# EAGLE schematic smartstand-amplifier-rev-a (EAGLE 7.3.0)

## Sheet 1 of 5
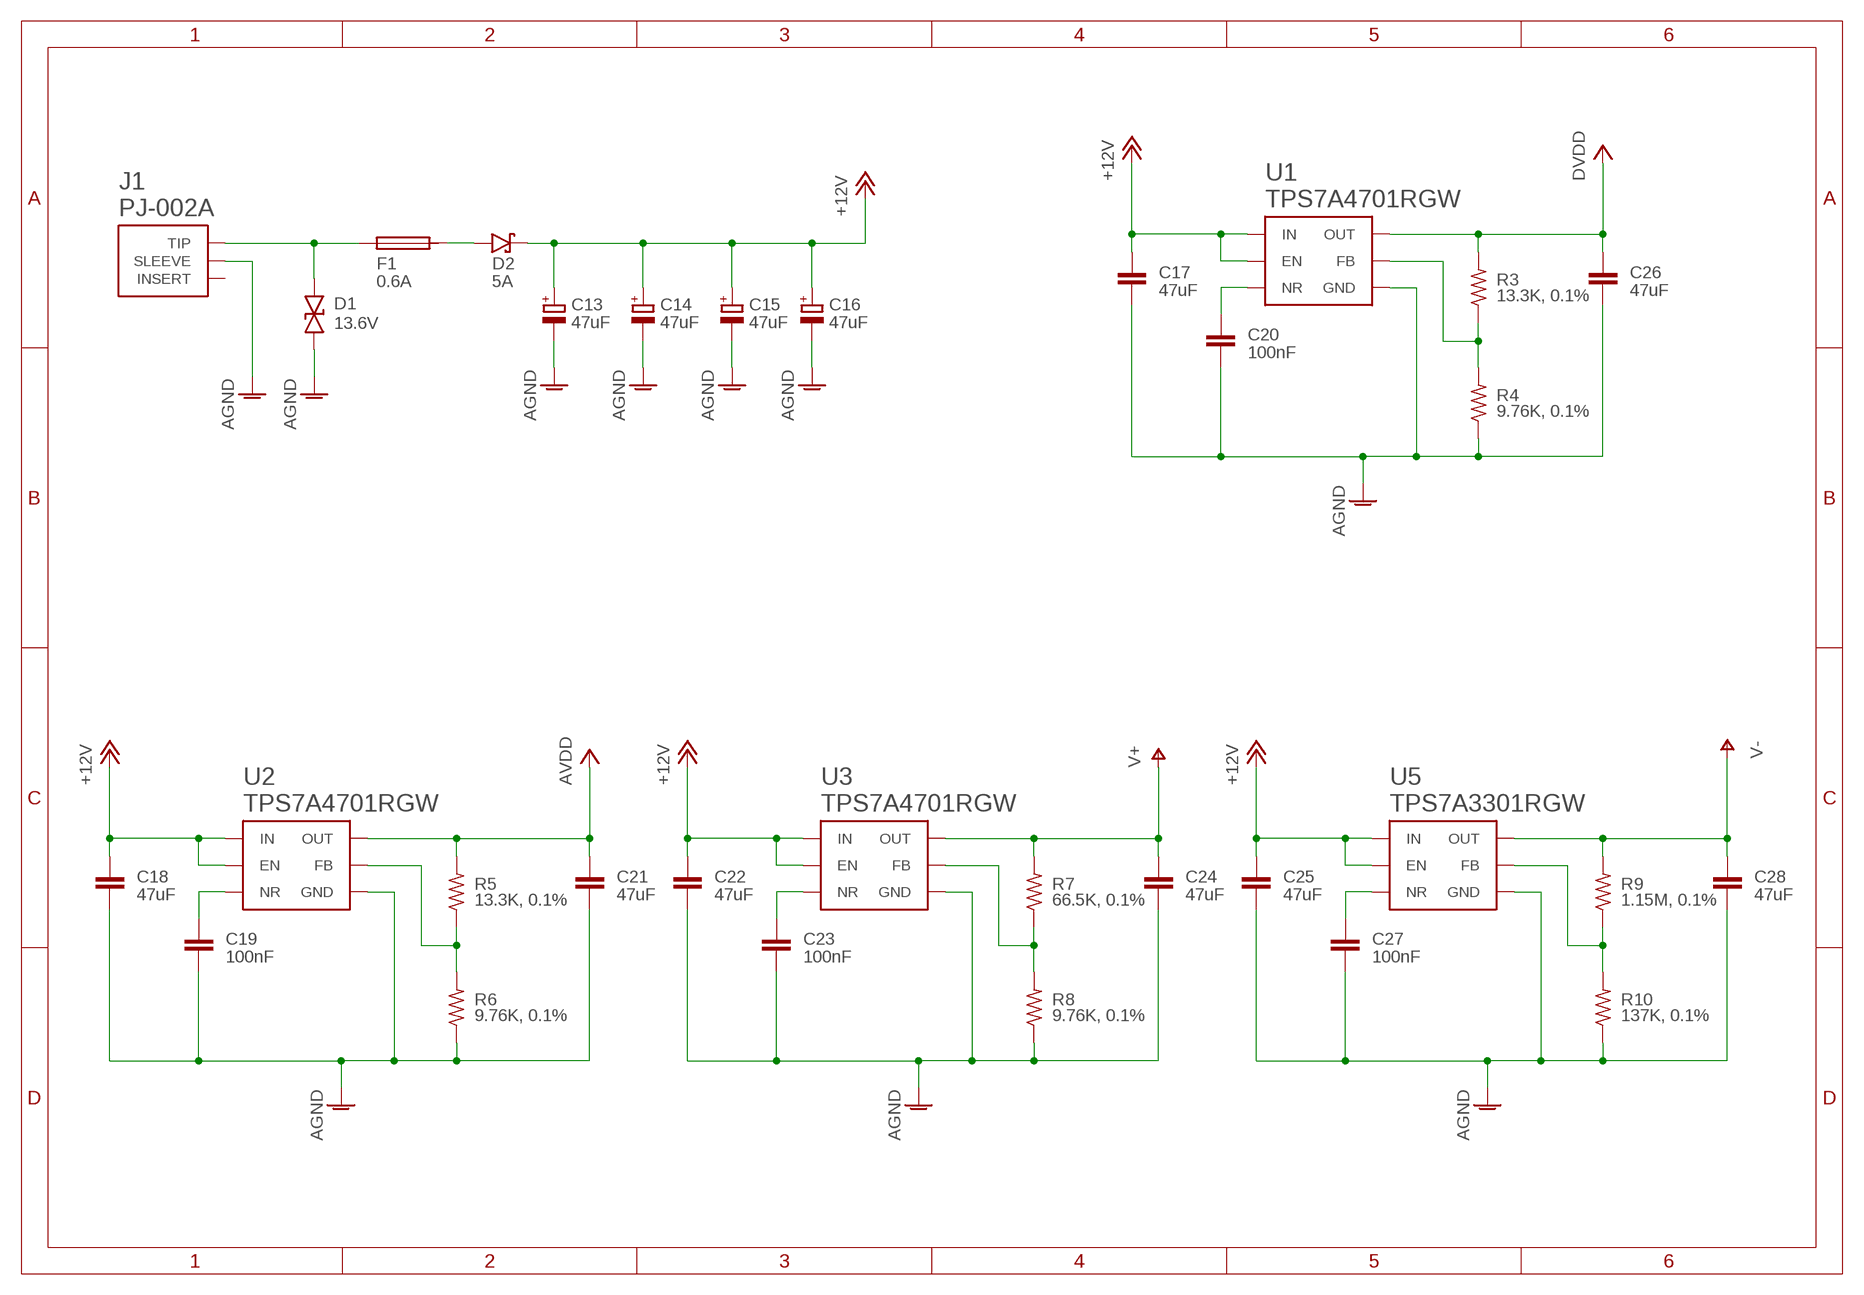
[diagram p0: schematic, sheet 1]

### Parts
C13  47uF  CPOL-EUCHEMICON_F55  [CHEMICON_F55]
C14  47uF  CPOL-EUCHEMICON_F55  [CHEMICON_F55]
C15  47uF  CPOL-EUCHEMICON_F55  [CHEMICON_F55]
C16  47uF  CPOL-EUCHEMICON_F55  [CHEMICON_F55]
C17  47uF  CAPACITOR-0805  [C0805]
C18  47uF  CAPACITOR-0805  [C0805]
C19  100nF  CAPACITOR-0402  [C0402]
C20  100nF  CAPACITOR-0402  [C0402]
C21  47uF  CAPACITOR-0805  [C0805]
C22  47uF  CAPACITOR-0805  [C0805]
C23  100nF  CAPACITOR-0402  [C0402]
C24  47uF  CAPACITOR-0805  [C0805]
C25  47uF  CAPACITOR-0805  [C0805]
C26  47uF  CAPACITOR-0805  [C0805]
C27  100nF  CAPACITOR-0402  [C0402]
C28  47uF  CAPACITOR-0805  [C0805]
D1  13.6V  SUPPRESSOR-DUAL-SMA  [SMA]
D2  5A  PMEG3050BEP  [SOD128]
F1  0.6A  LITTLEFUSE2920L  [2920L]
J1  PJ-002A  [PJ-002A]
R3  13.3K, 0.1%  R-US-VERTICALR0402  [R0402]
R4  9.76K, 0.1%  R-US-VERTICALR0402  [R0402]
R5  13.3K, 0.1%  R-US-VERTICALR0402  [R0402]
R6  9.76K, 0.1%  R-US-VERTICALR0402  [R0402]
R7  66.5K, 0.1%  R-US-VERTICALR0402  [R0402]
R8  9.76K, 0.1%  R-US-VERTICALR0402  [R0402]
R9  1.15M, 0.1%  R-US-VERTICALR0402  [R0402]
R10  137K, 0.1%  R-US-VERTICALR0402  [R0402]
U1  TPS7A4701RGW  [S-PVQFN-N20]
U2  TPS7A4701RGW  [S-PVQFN-N20]
U3  TPS7A4701RGW  [S-PVQFN-N20]
U5  TPS7A3301RGW  [S-PVQFN-N20]

### Nets
+10V: C24.1 R7.2 U3.P$1(OUT) U3.P$20(OUT) ; supply symbol labelled V+
+12V: C13.+ C14.+ C15.+ C16.+ C17.1 C18.1 C22.1 C25.1 D2.C U1.P$13(EN) U1.P$15(IN) U1.P$16(IN) U2.P$13(EN) U2.P$15(IN) U2.P$16(IN) U3.P$13(EN) U3.P$15(IN) U3.P$16(IN) U5.P$13(EN) U5.P$15(IN) U5.P$16(IN) ; also sheet 3
AGND: C13.- C14.- C15.- C16.- C17.2 C18.2 C19.2 C20.2 C21.2 C22.2 C23.2 C24.2 C25.2 C26.2 C27.2 C28.2 D1.A J1.2(SLEEVE) R4.1 R6.1 R8.1 R10.1 U1.P$7(GND) U1.P$21(GND) U1.P$22(GND) U1.P$23(GND) U1.P$24(GND) U1.P$25(GND) U1.P$26(GND) U1.P$27(GND) U1.P$28(GND) U1.P$29(GND) U1.P$EP(GND) U2.P$7(GND) U2.P$21(GND) U2.P$22(GND) U2.P$23(GND) U2.P$24(GND) U2.P$25(GND) U2.P$26(GND) U2.P$27(GND) U2.P$28(GND) U2.P$29(GND) U2.P$EP(GND) U3.P$7(GND) U3.P$21(GND) U3.P$22(GND) U3.P$23(GND) U3.P$24(GND) U3.P$25(GND) U3.P$26(GND) U3.P$27(GND) U3.P$28(GND) U3.P$29(GND) U3.P$EP(GND) U5.P$7(GND) U5.P$21(GND) U5.P$22(GND) U5.P$23(GND) U5.P$24(GND) U5.P$25(GND) U5.P$26(GND) U5.P$27(GND) U5.P$28(GND) U5.P$29(GND) U5.P$EP(GND) ; also sheet 2,3,4,5
AVDD: C21.1 R5.2 U2.P$1(OUT) U2.P$20(OUT) ; also sheet 2
DVDD: C26.1 R3.2 U1.P$1(OUT) U1.P$20(OUT) ; also sheet 2
N$7: D1.C F1.P$1 J1.1(TIP)
N$8: D2.A F1.P$2
N$9: C20.1 U1.P$14(NR)
N$10: C19.1 U2.P$14(NR)
N$11: R3.1 R4.2 U1.P$3(FB)
N$12: R5.1 R6.2 U2.P$3(FB)
N$13: C23.1 U3.P$14(NR)
N$14: R7.1 R8.2 U3.P$3(FB)
N$15: C27.1 U5.P$14(NR)
N$16: R9.1 R10.2 U5.P$3(FB)
V-: C28.1 R9.2 U5.P$1(OUT) U5.P$20(OUT) ; also sheet 3,4
Unconnected: J1.3(INSERT)

## Sheet 2 of 5
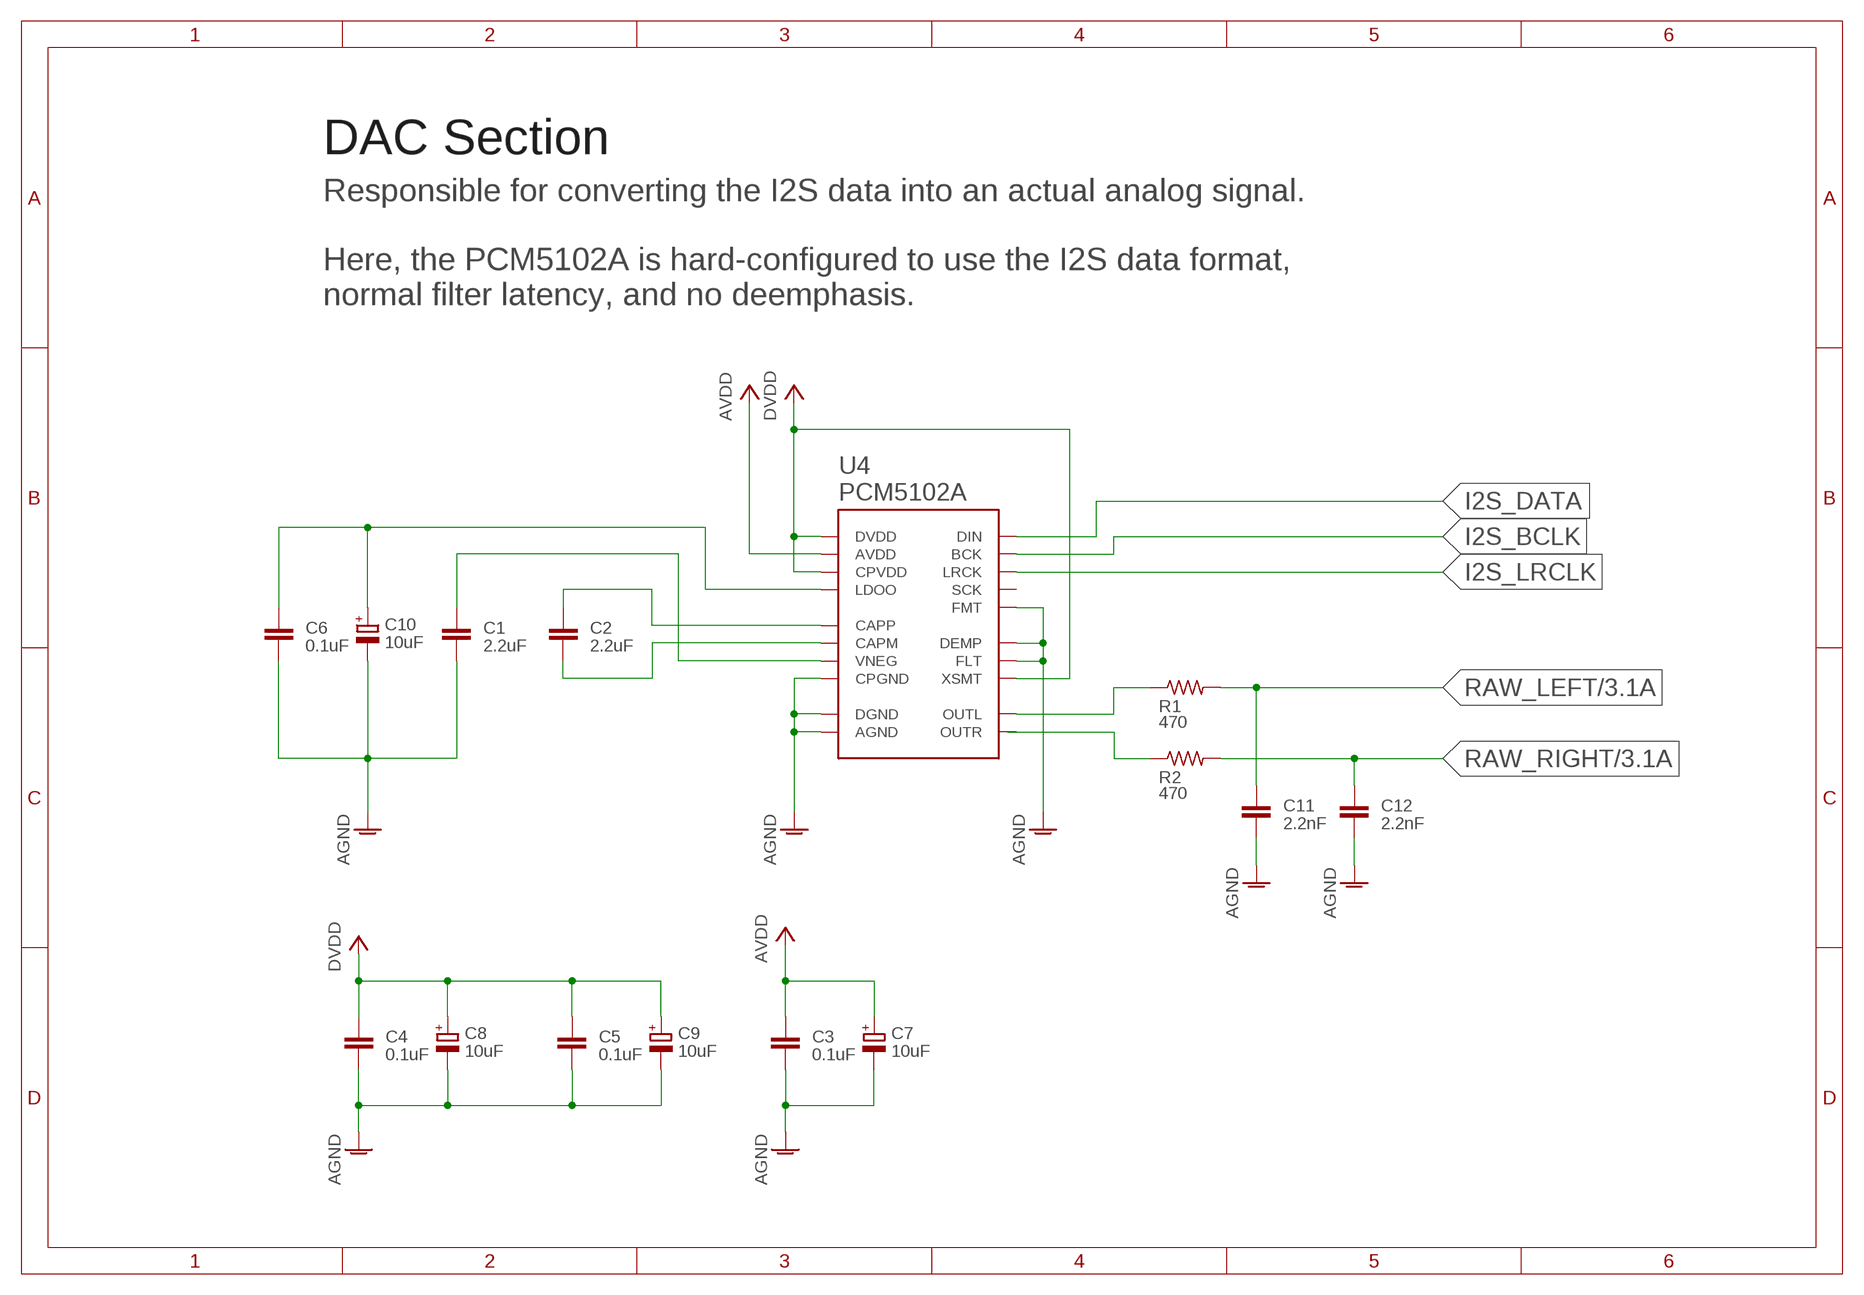
[diagram p1: schematic, sheet 2]

### Parts
C1  2.2uF  CAPACITOR-0603  [C0603]
C2  2.2uF  CAPACITOR-0603  [C0603]
C3  0.1uF  CAPACITOR-0402  [C0402]
C4  0.1uF  CAPACITOR-0402  [C0402]
C5  0.1uF  CAPACITOR-0402  [C0402]
C6  0.1uF  CAPACITOR-0402  [C0402]
C7  10uF  CPOL-EUB  [PANASONIC_B]
C8  10uF  CPOL-EUB  [PANASONIC_B]
C9  10uF  CPOL-EUB  [PANASONIC_B]
C10  10uF  CPOL-EUB  [PANASONIC_B]
C11  2.2nF  CAPACITOR-0402  [C0402]
C12  2.2nF  CAPACITOR-0402  [C0402]
R1  470  R-US_R0402  [R0402]
R2  470  R-US_R0402  [R0402]
U4  PCM5102A  [R-PDSO-G20]

### Nets
AGND: C1.2 C3.2 C4.2 C5.2 C6.2 C7.- C8.- C9.- C10.- C11.2 C12.2 U4.P$3(CPGND) U4.P$9(AGND) U4.P$10(DEMP) U4.P$11(FLT) U4.P$16(FMT) U4.P$19(DGND) ; also sheet 1,3,4,5
AVDD: C3.1 C7.+ U4.P$8(AVDD) ; also sheet 1
DVDD: C4.1 C5.1 C8.+ C9.+ U4.P$1(CPVDD) U4.P$17(XSMT) U4.P$20(DVDD) ; also sheet 1
I2S_BCLK: U4.P$13(BCK)
I2S_DATA: U4.P$14(DIN)
I2S_LRCLK: U4.P$15(LRCK)
N$1: C2.1 U4.P$2(CAPP)
N$2: C2.2 U4.P$4(CAPM)
N$3: C1.1 U4.P$5(VNEG)
N$4: C6.1 C10.+ U4.P$18(LDOO)
N$5: R1.1 U4.P$6(OUTL)
N$6: R2.1
RAW_LEFT: C11.1 R1.2 ; also sheet 3
RAW_RIGHT: C12.1 R2.2 ; also sheet 3
Unconnected: U4.P$7(OUTR) U4.P$12(SCK)

### Notes on the sheet
- DAC Section
- Responsible for converting the I2S data into an actual analog signal.
  
  Here, the PCM5102A is hard-configured to use the I2S data format, 
  normal filter latency, and no deemphasis.

## Sheet 3 of 5
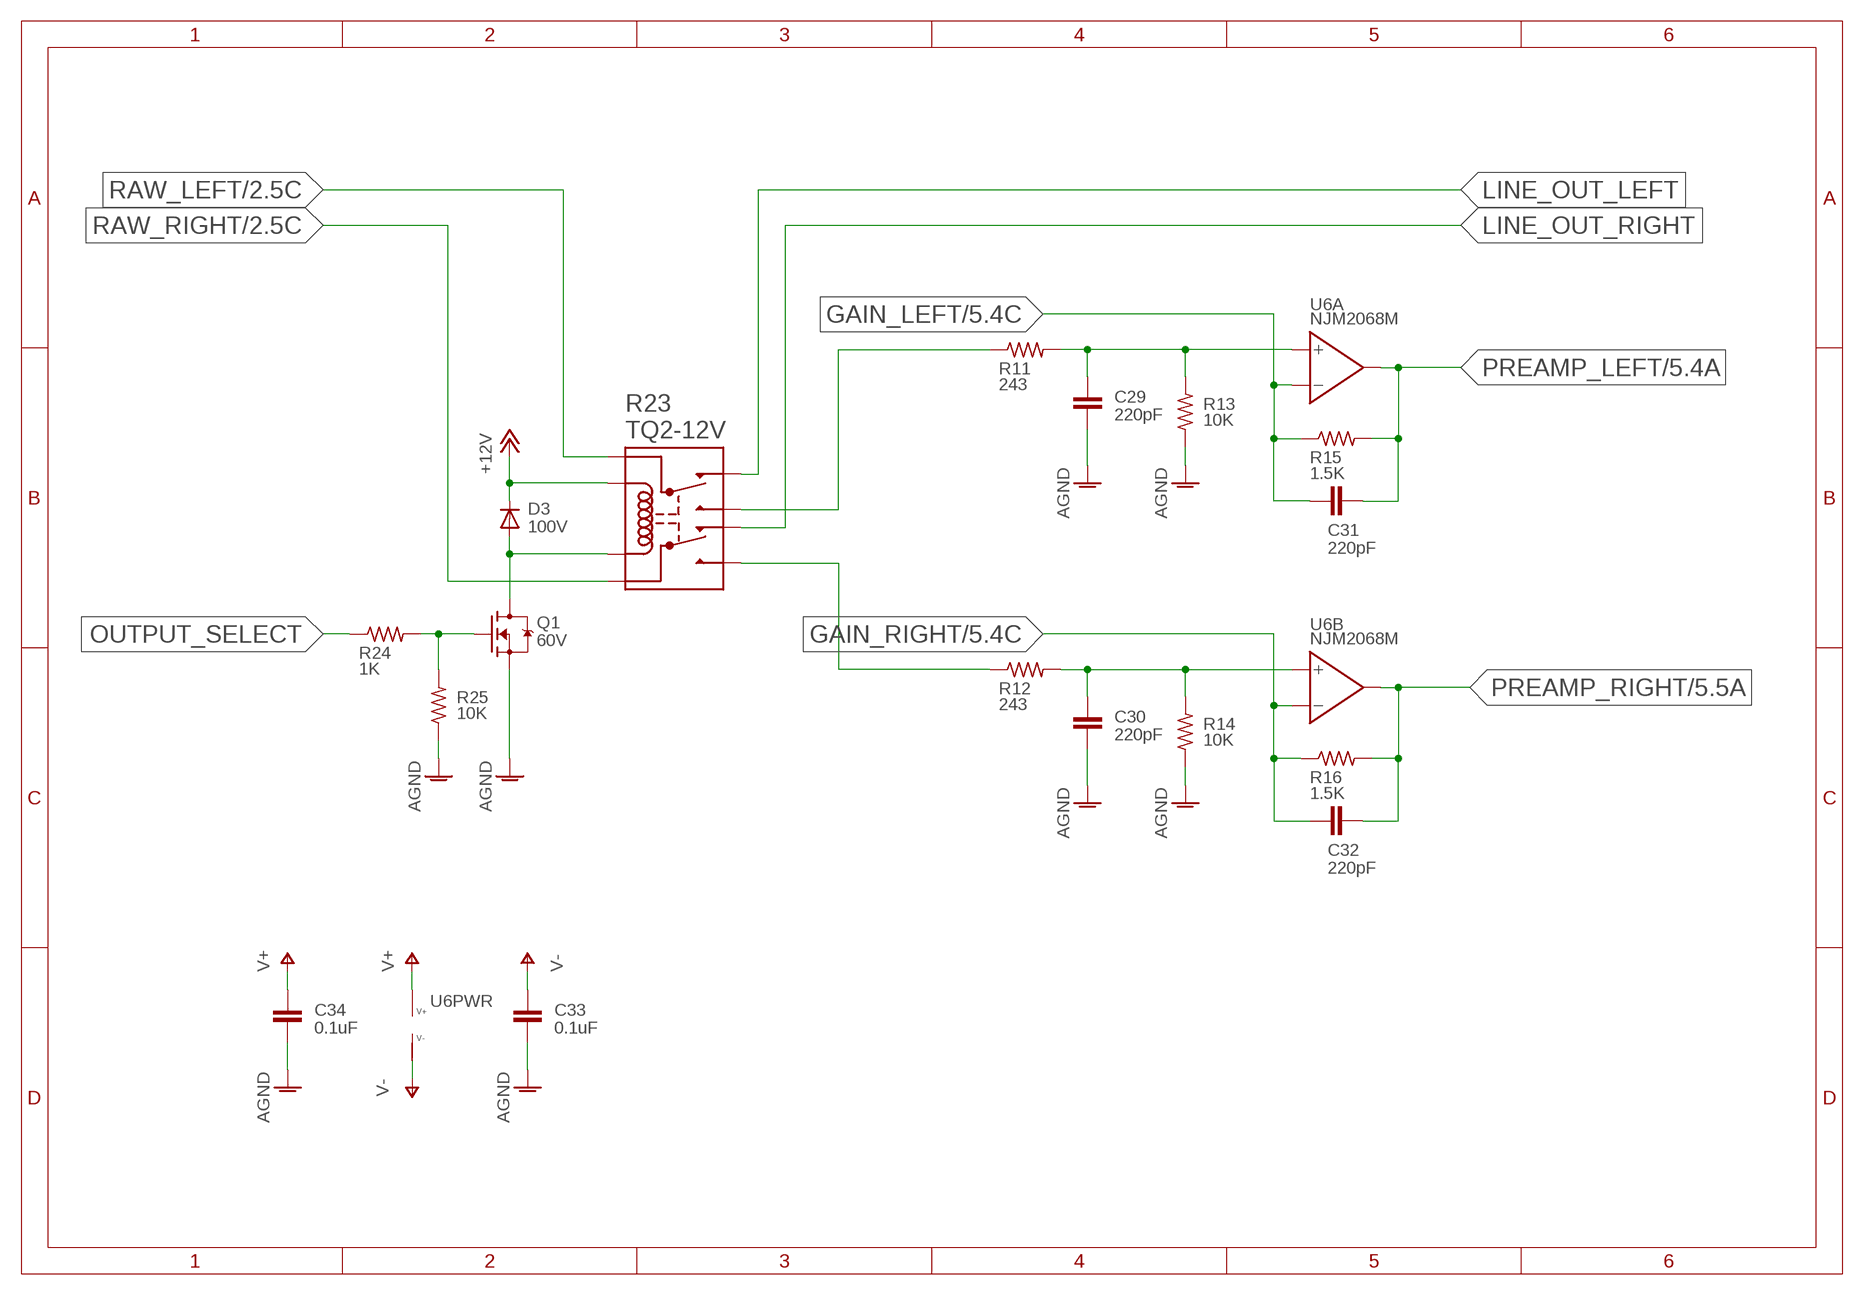
[diagram p2: schematic, sheet 3]

### Parts
C29  220pF  CAPACITOR-0402  [C0402]
C30  220pF  CAPACITOR-0402  [C0402]
C31  220pF  CAPACITOR-HORIZONTAL-0402  [C0402]
C32  220pF  CAPACITOR-HORIZONTAL-0402  [C0402]
C33  0.1uF  CAPACITOR-0402  [C0402]
C34  0.1uF  CAPACITOR-0402  [C0402]
D3  100V  DIODE-VERTICALSOD123  [SOD123]
Q1  60V  N-MOSFET-SC70  [SC-70]
R11  243  R-US_R0402  [R0402]
R12  243  R-US_R0402  [R0402]
R13  10K  R-US-VERTICALR0402  [R0402]
R14  10K  R-US-VERTICALR0402  [R0402]
R15  1.5K  R-US_R0402  [R0402]
R16  1.5K  R-US_R0402  [R0402]
R23  TQ2-12V  [TQ2]
R24  1K  R-US_R0402  [R0402]
R25  10K  R-US-VERTICALR0402  [R0402]
U6  NJM2068M  [DMP8]

### Nets
+12V: D3.C R23.P$1(COIL_P) ; also sheet 1
AGND: C29.2 C30.2 C33.2 C34.2 Q1.P$2(S) R13.1 R14.1 R25.1 ; also sheet 1,2,4,5
GAIN_LEFT: C31.1 R15.1 U6.P$2(A:-IN) ; also sheet 5
GAIN_RIGHT: C32.1 R16.1 U6.P$6(B:-IN) ; also sheet 5
LINE_OUT_LEFT: R23.P$2(NC1)
LINE_OUT_RIGHT: R23.P$9(NC2)
N$17: C29.1 R11.2 R13.2 U6.P$3(A:+IN)
N$18: C30.1 R12.2 R14.2 U6.P$5(B:+IN)
N$23: R11.1 R23.P$4(NO1)
N$26: R12.1 R23.P$7(NO2)
N$27: Q1.P$1(G) R24.2 R25.2
N$29: D3.A Q1.P$3(D) R23.P$10(COIL_N)
OUTPUT_SELECT: R24.1
PREAMP_LEFT: C31.2 R15.2 U6.P$1(A:OUT) ; also sheet 5
PREAMP_RIGHT: C32.2 R16.2 U6.P$7(B:OUT) ; also sheet 5
RAW_LEFT: R23.P$3(COM1) ; also sheet 2
RAW_RIGHT: R23.P$8(COM2) ; also sheet 2
V+: C34.1 U6.P$8(PWR:V+) ; also sheet 4
V-: C33.1 U6.P$4(PWR:V-) ; also sheet 1,4

## Sheet 4 of 5
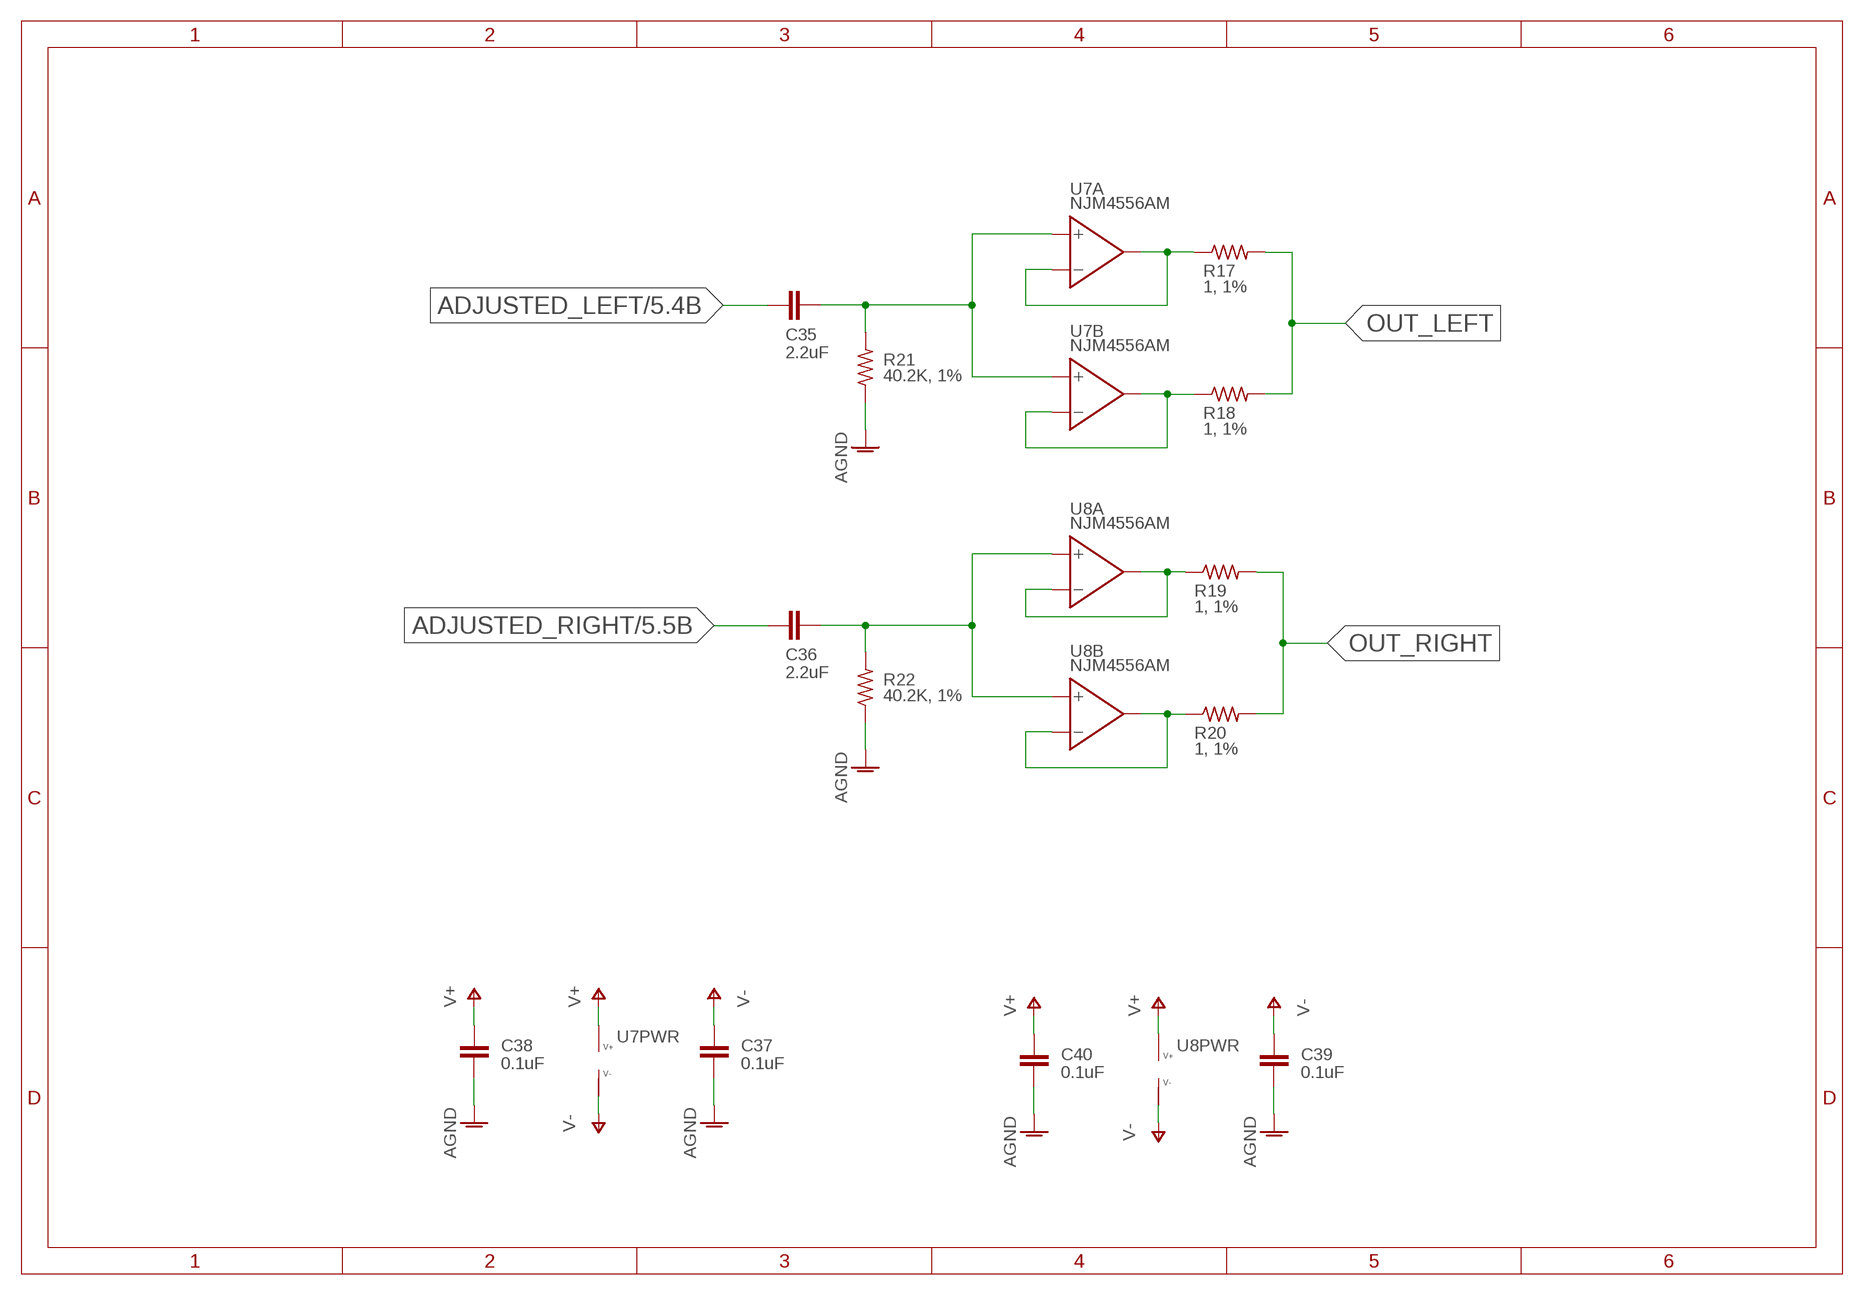
[diagram p3: schematic, sheet 4]

### Parts
C35  2.2uF  CAPACITOR-HORIZONTAL-0603  [C0603]
C36  2.2uF  CAPACITOR-HORIZONTAL-0603  [C0603]
C37  0.1uF  CAPACITOR-0402  [C0402]
C38  0.1uF  CAPACITOR-0402  [C0402]
C39  0.1uF  CAPACITOR-0402  [C0402]
C40  0.1uF  CAPACITOR-0402  [C0402]
R17  1, 1%  R-US_R1206  [R1206]
R18  1, 1%  R-US_R1206  [R1206]
R19  1, 1%  R-US_R1206  [R1206]
R20  1, 1%  R-US_R1206  [R1206]
R21  40.2K, 1%  R-US-VERTICALR0402  [R0402]
R22  40.2K, 1%  R-US-VERTICALR0402  [R0402]
U7  NJM4556AM  [DMP8]
U8  NJM4556AM  [DMP8]

### Nets
ADJUSTED_LEFT: C35.1 ; also sheet 5
ADJUSTED_RIGHT: C36.1 ; also sheet 5
AGND: C37.2 C38.2 C39.2 C40.2 R21.1 R22.1 ; also sheet 1,2,3,5
N$19: C35.2 R21.2 U7.P$3(A:+IN) U7.P$5(B:+IN)
N$20: C36.2 R22.2 U8.P$3(A:+IN) U8.P$5(B:+IN)
N$21: R17.1 U7.P$1(A:OUT) U7.P$2(A:-IN)
N$22: R18.1 U7.P$6(B:-IN) U7.P$7(B:OUT)
N$24: R19.1 U8.P$1(A:OUT) U8.P$2(A:-IN)
N$25: R20.1 U8.P$6(B:-IN) U8.P$7(B:OUT)
OUT_LEFT: R17.2 R18.2
OUT_RIGHT: R19.2 R20.2
V+: C38.1 C40.1 U7.P$8(PWR:V+) U8.P$8(PWR:V+) ; also sheet 3
V-: C37.1 C39.1 U7.P$4(PWR:V-) U8.P$4(PWR:V-) ; also sheet 1,3

## Sheet 5 of 5
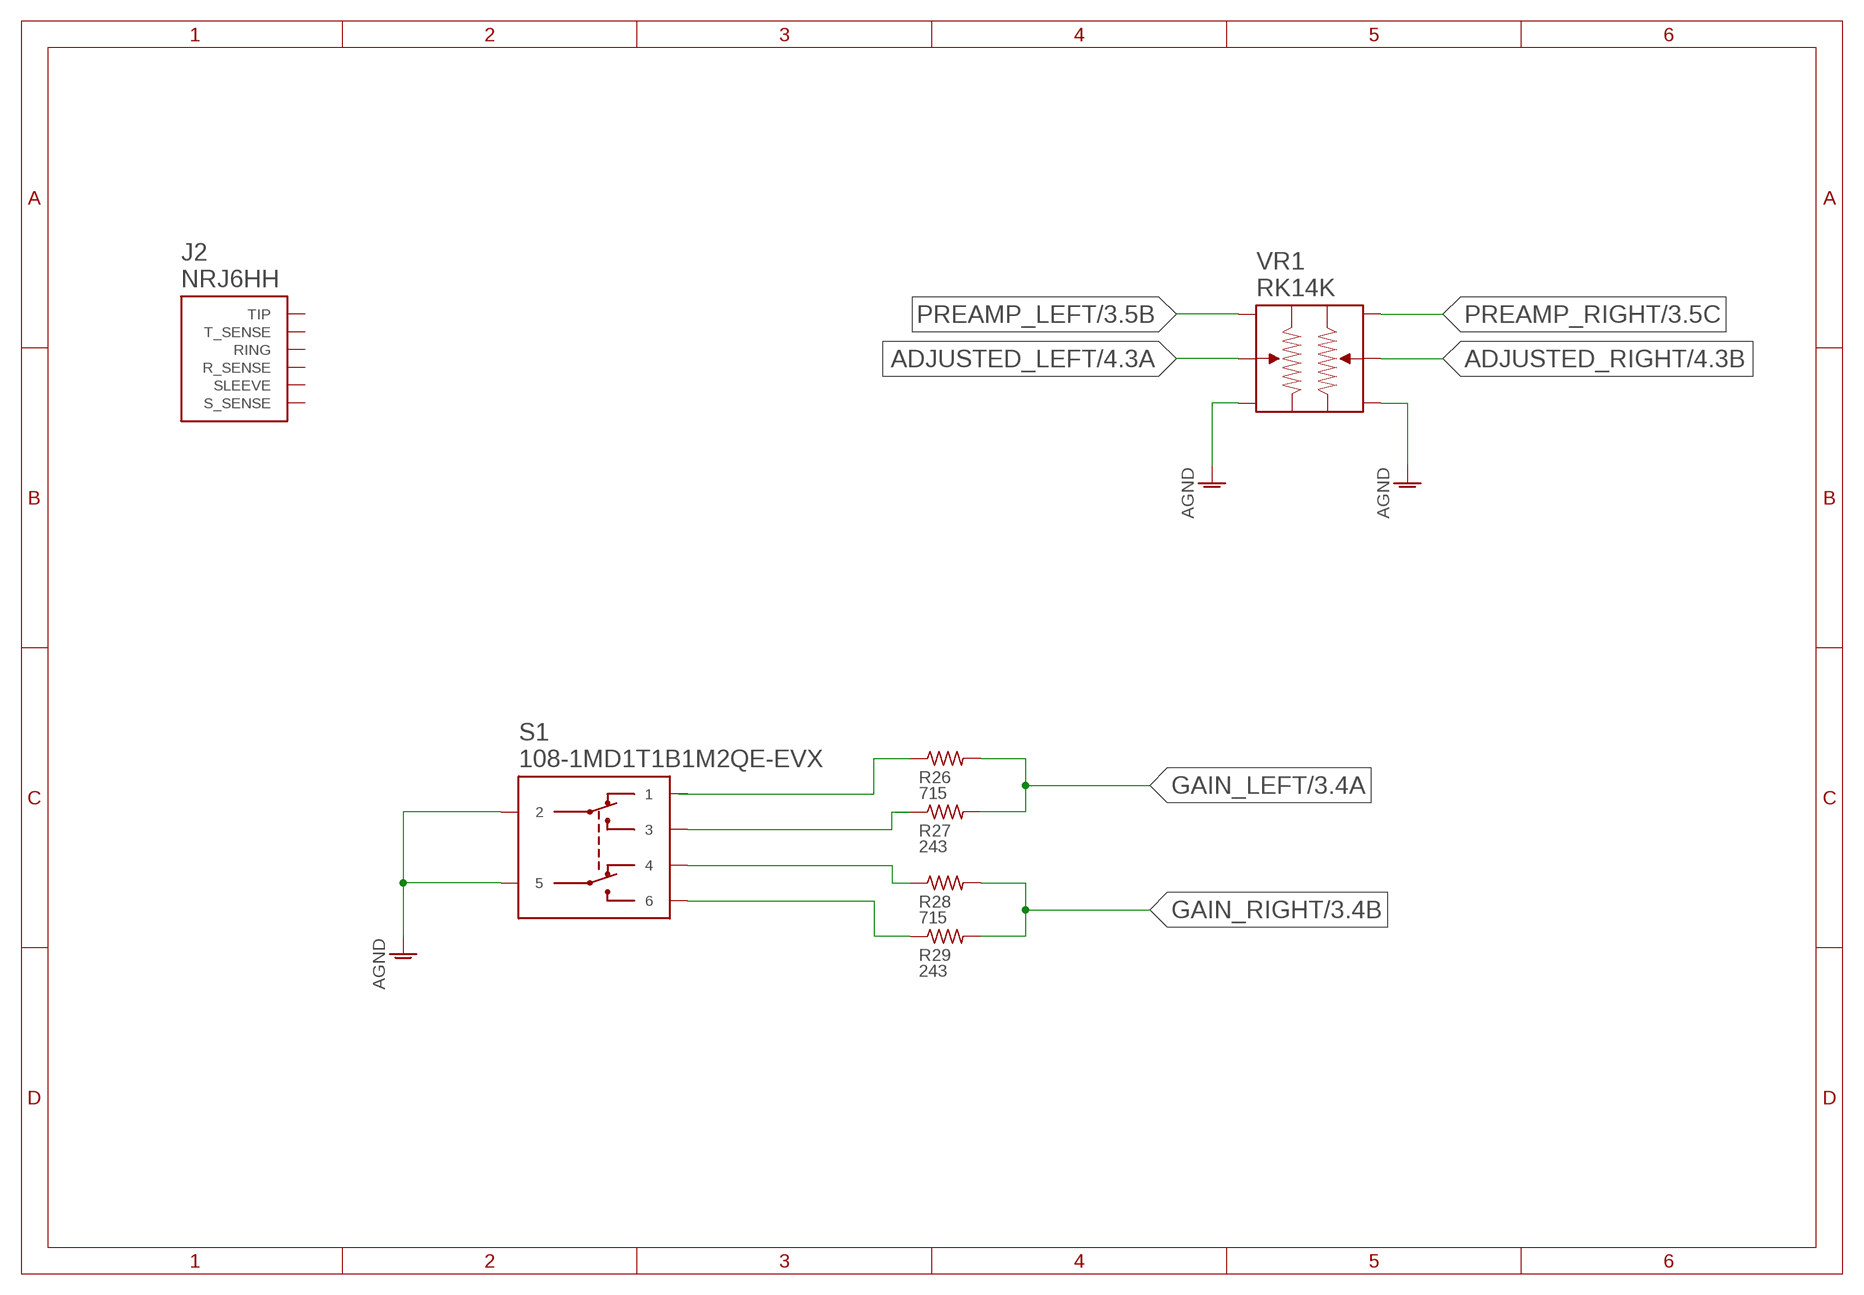
[diagram p4: schematic, sheet 5]

### Parts
J2  NRJ6HH  [NRJ6HH]
R26  715  R-US_R0805  [R0805]
R27  243  R-US_R0805  [R0805]
R28  715  R-US_R0805  [R0805]
R29  243  R-US_R0805  [R0805]
S1  108-1MD1T1B1M2QE-EVX  [108-1MD1T1B1M2QE-EVX]
VR1  RK14K  [RK14K]

### Nets
ADJUSTED_LEFT: VR1.L2(WIPER_L) ; also sheet 4
ADJUSTED_RIGHT: VR1.R2(WIPER_R) ; also sheet 4
AGND: S1.P$2 S1.P$5 VR1.L3(OUT_L) VR1.R3(OUT_R) ; also sheet 1,2,3,4
GAIN_LEFT: R26.2 R27.2 ; also sheet 3
GAIN_RIGHT: R28.2 R29.2 ; also sheet 3
N$28: R26.1
N$30: R27.1 S1.P$3
N$31: R28.1 S1.P$4
N$32: R29.1 S1.P$6
PREAMP_LEFT: VR1.L1(IN_L) ; also sheet 3
PREAMP_RIGHT: VR1.R1(IN_R) ; also sheet 3
Unconnected: J2.R(RING) J2.RN(R_SENSE) J2.S(SLEEVE) J2.SN(S_SENSE) J2.T(TIP) J2.TN(T_SENSE) S1.P$1

## Library data of the parts
C1 C2 = passives:CAPACITOR: Capacitor; PN: GRM188R61C225KE15D
C3-C6 = passives:CAPACITOR: Capacitor; PN: GRM155R71C104KA88D
C7-C10 = passives:CPOL-EU: POLARIZED CAPACITOR, European symbol; PN: EEE-1CA100SR
C11 C12 C17-C30 C33 C34 C37-C40 = passives:CAPACITOR: Capacitor
C13-C16 = passives:CPOL-EU: POLARIZED CAPACITOR, European symbol; PN: EMVA250ADA470MF55G
C31 C32 C35 C36 = passives:CAPACITOR-HORIZONTAL: Capacitor, horizontal
D1 = diodes:SUPPRESSOR-DUAL-; PN: P4SMA16CA
D2 = nxp:PMEG3050BEP: 5A low Vf MEGA Schottky barrier rectiﬁer Planar Maximum Efﬁciency General Application (MEGA) Schottky barrier rectiﬁer with an integrated guard ring for stress protection, encapsulated in a SOD128 small and ﬂat lead Surface-Mounted Device (SMD) plastic package.; PN: PMEG3050BEP,115
D3 = diodes:DIODE-VERTICAL: DIODE; PN: BAT46W-E3-08
F1 = fuse:LITTLEFUSE: LITTLEFUSE Picofuse/slow Littlefuse; PN: 2920L030DR
J1 = cui:PJ-002A: DC Power Jack • 2.0 mm center pin • 2.5 A rating • right-angle orientation • through hole; PN: PJ-002A
J2 = neutrik:NRJ6HH: 1/4" stereo jack, switched, half threaded nose
Q1 = transistors:N-MOSFET: N-Channel MOSFET; PN: NX7002AKW,115
R1 R2 R11 R12 R15-R20 R24 R26-R29 = passives:R-US_: RESISTOR, American symbol
R3-R10 R13 R14 R21 R22 R25 = passives:R-US-VERTICAL
R23 = panasonic:TQ2: 5 mm Low profile, 2 Form C and 2 A (surface mount type) relays
S1 = mountain-switch:108-1MD1T1B1M2QE-EVX: Toggle Switch, DPDT, 13 x 11.5mm
U1-U3 = texas-instruments:TPS7A4701: 36V, 1A, 4µVrms noise, RF LDO Voltage Regulator
U4 = texas-instruments:PCM5102A: 2VRMS DirectPath™, 112dB Audio Stereo DAC with 32-bit, 384kHz PCM Interface The PCM510xA devices are a family of monolithic CMOS integrated circuits that include a stereo digital-to-analog converter and additional support circuitry in a small TSSOP package. The PCM510xA uses the latest generation of TI’s advanced segment-DAC architecture to achieve excellent dynamic performance and improved tolerance to clock jitter. The PCM510xA provides 2.1VRMS ground centered outputs, allowing designers to eliminate DC blocking capacitors on the output, as well as external muting circuits traditionally associated with single supply line drivers. The integrated line driver surpasses all other charge-pump based line drivers by supporting loads down to 1kΩ. By supporting loads down to 1kΩ, the PCM510xA can essentially drive up to 10 products in parallel. (LCD TV, DVDR, AV Receivers etc). The integrated PLL on the device removes the requirement for a system clock (commonly known as master clock), allowing a 3-wire I2S connection and reducing system EMI. Intelligent clock error and PowerSense under voltage protection utilizes a two level mute system for pop-free performance. Upon clock error or system power failure, the device digitally attenuates the data (or last known good data), then mutes the analog circuit. Compared with existing DAC technology, the PCM510xA family offers up to 20dB lower out-of-band noise, reducing EMI and aliasing in downstream amplifiers/ADCs. (from traditional 100kHz OBN measurements all the way to 3MHz) The PCM510xA accepts industry-standard audio data formats with 16- to 32-bit data. Sample rates up to 384kHz are supported.
U5 = texas-instruments:TPS7A33: –36V, 1A, Ultralow-Noise Negative Voltage Regulator
U6 = njr:NJM2068: LOW-NOISE DUAL OPERATIONAL AMPLIFIER The NJM2068 is a high performance, low noise dual operational amplifier. This amplifier features popular pin-out, superior noise performance, and superior total harmonic distortion. This amplifier also features guaranteed noise performance with substantially higher gain-bandwidth product and slew rate, which far exceeds that of the 4558 type amplifier. The specially designed low noise input transistors allow the NJM2068 to be used in very low noise signal processing applications such as audio preamplifiers and servo error amplifier.
U7 U8 = njr:NJM4556A: DUAL HIGH CURRENT OPERATIONAL AMPLIFIER The NJM4556A integrated circuit is a high-gain,high output current dual operational amplifier capable of driving ±70mA into 150Ω loads ( ±10.5V output voltage ),and operating low supply voltage ( V+/V-=±2V~ ). The NJM4556A combines many of the features of the popular NJM4558 as well as having the capability of driving 150Ω loads.In addition,the wide band-width,low noise,high slew rate and low distortion of the NJM4556A make it ideal for many audio,telecommunications and instrumentation applications.
VR1 = alps:RK14K: 14mm Size Insulated Shaft Snap-in Type RK14K Series